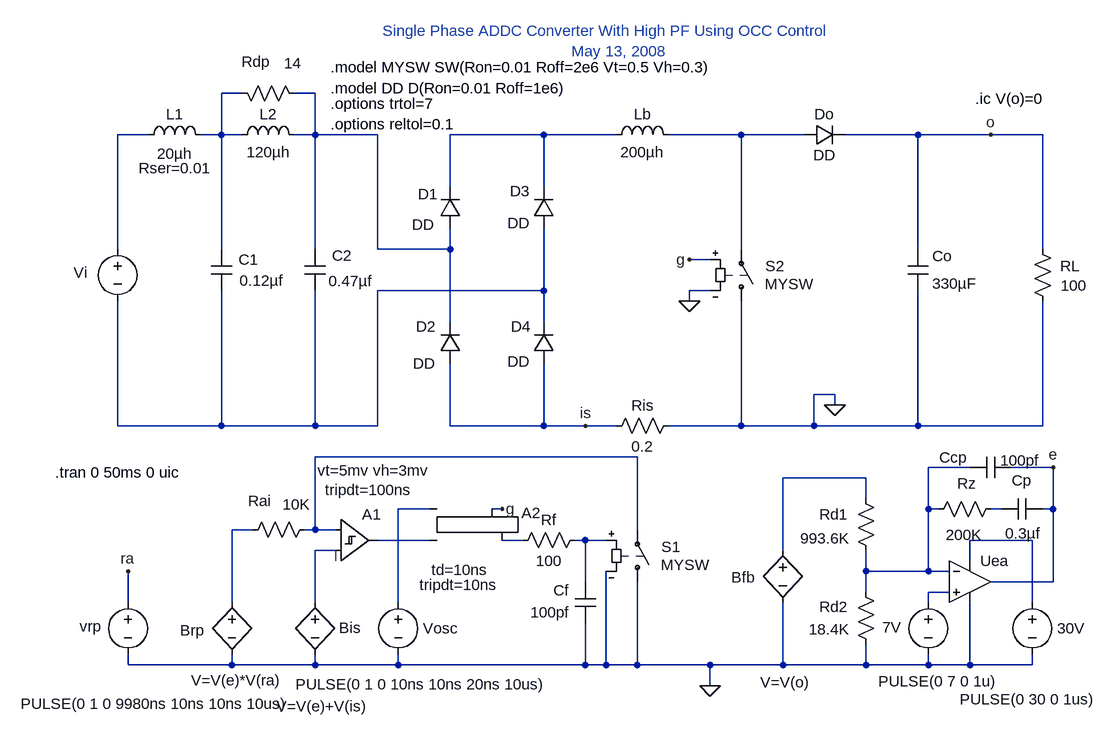
[diagram p0: schematic Single_Phase_High_PF_ACDC_Converter_with_Universalopamp2.asc]
Single_Phase_High_PF_ACDC_Converter_with_Universalopamp2.asc, the LTspice schematic file:
Version 4
SHEET 1 880 680
WIRE -2752 -1920 -2784 -1920
WIRE -2640 -1920 -2672 -1920
WIRE -2896 -1856 -2944 -1856
WIRE -2784 -1856 -2784 -1920
WIRE -2784 -1856 -2816 -1856
WIRE -2752 -1856 -2784 -1856
WIRE -2640 -1856 -2640 -1920
WIRE -2640 -1856 -2672 -1856
WIRE -2544 -1856 -2640 -1856
WIRE -2288 -1856 -2432 -1856
WIRE -2176 -1856 -2288 -1856
WIRE -1984 -1856 -2096 -1856
WIRE -1888 -1856 -1984 -1856
WIRE -1712 -1856 -1824 -1856
WIRE -1600 -1856 -1712 -1856
WIRE -1520 -1856 -1600 -1856
WIRE -2432 -1776 -2432 -1856
WIRE -2288 -1776 -2288 -1856
WIRE -2944 -1680 -2944 -1856
WIRE -2784 -1680 -2784 -1856
WIRE -2640 -1680 -2640 -1856
WIRE -2544 -1680 -2544 -1856
WIRE -2432 -1680 -2432 -1712
WIRE -2432 -1680 -2544 -1680
WIRE -1984 -1680 -1984 -1856
WIRE -1712 -1680 -1712 -1856
WIRE -1520 -1680 -1520 -1856
WIRE -2032 -1664 -2064 -1664
WIRE -2288 -1616 -2288 -1712
WIRE -2288 -1616 -2544 -1616
WIRE -2032 -1616 -2064 -1616
WIRE -2064 -1600 -2064 -1616
WIRE -2432 -1568 -2432 -1680
WIRE -2288 -1568 -2288 -1616
WIRE -1840 -1456 -1872 -1456
WIRE -1840 -1440 -1840 -1456
WIRE -2944 -1408 -2944 -1600
WIRE -2784 -1408 -2784 -1616
WIRE -2784 -1408 -2944 -1408
WIRE -2640 -1408 -2640 -1616
WIRE -2640 -1408 -2784 -1408
WIRE -2544 -1408 -2544 -1616
WIRE -2544 -1408 -2640 -1408
WIRE -2432 -1408 -2432 -1504
WIRE -2288 -1408 -2288 -1504
WIRE -2288 -1408 -2432 -1408
WIRE -2224 -1408 -2288 -1408
WIRE -2176 -1408 -2224 -1408
WIRE -1984 -1408 -1984 -1600
WIRE -1984 -1408 -2096 -1408
WIRE -1872 -1408 -1872 -1456
WIRE -1872 -1408 -1984 -1408
WIRE -1712 -1408 -1712 -1616
WIRE -1712 -1408 -1872 -1408
WIRE -1520 -1408 -1520 -1600
WIRE -1520 -1408 -1712 -1408
WIRE -2144 -1360 -2640 -1360
WIRE -1632 -1344 -1696 -1344
WIRE -1504 -1344 -1568 -1344
WIRE -1792 -1328 -1920 -1328
WIRE -1792 -1296 -1792 -1328
WIRE -2464 -1280 -2512 -1280
WIRE -2352 -1280 -2368 -1280
WIRE -1696 -1280 -1696 -1344
WIRE -1680 -1280 -1696 -1280
WIRE -1584 -1280 -1600 -1280
WIRE -1504 -1280 -1504 -1344
WIRE -1504 -1280 -1520 -1280
WIRE -2736 -1248 -2768 -1248
WIRE -2640 -1248 -2640 -1360
WIRE -2640 -1248 -2656 -1248
WIRE -2608 -1248 -2640 -1248
WIRE -2144 -1248 -2144 -1360
WIRE -2464 -1232 -2544 -1232
WIRE -2320 -1232 -2352 -1232
WIRE -2224 -1232 -2240 -1232
WIRE -2192 -1232 -2224 -1232
WIRE -1536 -1232 -1632 -1232
WIRE -2608 -1216 -2640 -1216
WIRE -1920 -1216 -1920 -1328
WIRE -1632 -1200 -1632 -1232
WIRE -1792 -1184 -1792 -1216
WIRE -1696 -1184 -1696 -1280
WIRE -1696 -1184 -1792 -1184
WIRE -1664 -1184 -1696 -1184
WIRE -2224 -1168 -2224 -1232
WIRE -1504 -1168 -1504 -1280
WIRE -1504 -1168 -1600 -1168
WIRE -1792 -1152 -1792 -1184
WIRE -1664 -1152 -1696 -1152
WIRE -2928 -1136 -2928 -1184
WIRE -2768 -1136 -2768 -1248
WIRE -2640 -1136 -2640 -1216
WIRE -2512 -1136 -2512 -1280
WIRE -1696 -1136 -1696 -1152
WIRE -1536 -1136 -1536 -1232
WIRE -2928 -1040 -2928 -1056
WIRE -2768 -1040 -2768 -1056
WIRE -2768 -1040 -2928 -1040
WIRE -2640 -1040 -2640 -1056
WIRE -2640 -1040 -2768 -1040
WIRE -2512 -1040 -2512 -1056
WIRE -2512 -1040 -2640 -1040
WIRE -2224 -1040 -2224 -1104
WIRE -2224 -1040 -2512 -1040
WIRE -2192 -1040 -2192 -1184
WIRE -2192 -1040 -2224 -1040
WIRE -2144 -1040 -2144 -1168
WIRE -2144 -1040 -2192 -1040
WIRE -2032 -1040 -2144 -1040
WIRE -1920 -1040 -1920 -1136
WIRE -1920 -1040 -2032 -1040
WIRE -1792 -1040 -1792 -1072
WIRE -1792 -1040 -1920 -1040
WIRE -1696 -1040 -1696 -1056
WIRE -1696 -1040 -1792 -1040
WIRE -1632 -1040 -1632 -1136
WIRE -1632 -1040 -1696 -1040
WIRE -1536 -1040 -1536 -1056
WIRE -1536 -1040 -1632 -1040
WIRE -2032 -1008 -2032 -1040
FLAG -1600 -1856 o
FLAG -2928 -1184 ra
FLAG -2352 -1280 g
FLAG -1504 -1344 e
FLAG -2032 -1008 0
FLAG -2064 -1664 g
FLAG -2064 -1600 0
FLAG -2224 -1408 is
FLAG -1840 -1440 0
SYMBOL ind -2192 -1840 R270
WINDOW 0 32 56 VTop 0
WINDOW 3 5 56 VBottom 0
SYMATTR InstName Lb
SYMATTR Value 200µh
SYMATTR Type ind2
SYMATTR SpiceLine Rser=0.01
SYMBOL cap -1728 -1680 R0
WINDOW 0 38 11 Left 0
WINDOW 3 38 53 Left 0
SYMATTR InstName Co
SYMATTR Value 330µF
SYMATTR SpiceLine Rser=0.1
SYMBOL res -1536 -1696 R0
WINDOW 0 43 42 Left 0
WINDOW 3 44 72 Left 0
SYMATTR InstName RL
SYMATTR Value 100
SYMBOL res -2080 -1424 R90
WINDOW 0 0 56 VBottom 0
WINDOW 3 32 56 VTop 0
SYMATTR InstName Ris
SYMATTR Value 0.2
SYMBOL voltage -2928 -1152 R0
WINDOW 0 -74 53 Left 0
WINDOW 3 -165 172 Left 0
WINDOW 123 0 0 Left 0
WINDOW 39 0 0 Left 0
SYMATTR InstName vrp
SYMATTR Value PULSE(0 1 0 9980ns 10ns 10ns 10us)
SYMBOL bv -2768 -1152 R0
WINDOW 0 -80 59 Left 0
WINDOW 3 -63 136 Left 0
SYMATTR InstName Brp
SYMATTR Value V=V(e)*V(ra)
SYMBOL Digital\\diffschmtbuf -2608 -1296 R0
WINDOW 3 -17 -13 Left 0
WINDOW 123 -28 -43 Left 0
SYMATTR Value tripdt=100ns
SYMATTR Value2 vt=5mv vh=3mv
SYMATTR InstName A1
SYMBOL Digital\\srflop -2416 -1328 R0
WINDOW 3 -63 165 Left 0
WINDOW 123 -45 142 Left 0
SYMATTR Value tripdt=10ns
SYMATTR Value2 td=10ns
SYMATTR InstName A2
SYMBOL voltage -2512 -1152 R0
WINDOW 0 38 56 Left 0
WINDOW 3 -158 142 Left 0
WINDOW 123 0 0 Left 0
WINDOW 39 0 0 Left 0
SYMATTR InstName Vosc
SYMATTR Value PULSE(0 1 0 10ns 10ns 20ns 10us)
SYMBOL res -2640 -1264 R90
WINDOW 0 -13 85 VBottom 0
WINDOW 3 -39 29 VTop 0
SYMATTR InstName Rai
SYMATTR Value 10K
SYMBOL sw -2144 -1152 M180
WINDOW 0 37 70 Left 0
WINDOW 3 36 42 Left 0
SYMATTR InstName S1
SYMATTR Value MYSW
SYMBOL res -2224 -1248 R90
WINDOW 0 0 56 VBottom 0
WINDOW 3 32 56 VTop 0
SYMATTR InstName Rf
SYMATTR Value 100
SYMBOL cap -2208 -1168 M0
WINDOW 0 41 13 Left 0
WINDOW 3 40 47 Left 0
SYMATTR InstName Cf
SYMATTR Value 100pf
SYMBOL bv -2640 -1152 R0
WINDOW 0 37 55 Left 0
WINDOW 3 -59 176 Left 0
SYMATTR InstName Bis
SYMATTR Value V=V(e)+V(is)
SYMBOL res -1808 -1312 R0
WINDOW 0 -56 40 Left 0
WINDOW 3 -85 77 Left 0
SYMATTR InstName Rd1
SYMATTR Value 993.6K
SYMBOL res -1808 -1168 R0
WINDOW 0 -56 39 Left 0
WINDOW 3 -72 73 Left 0
SYMATTR InstName Rd2
SYMATTR Value 18.4K
SYMBOL res -1584 -1296 R90
WINDOW 0 -8 53 VBottom 0
WINDOW 3 40 57 VTop 0
SYMATTR InstName Rz
SYMATTR Value 200K
SYMBOL cap -1520 -1296 R90
WINDOW 0 -12 32 VBottom 0
WINDOW 3 38 31 VTop 0
SYMATTR InstName Cp
SYMATTR Value 0.3µf
SYMBOL cap -1568 -1360 R90
WINDOW 0 16 90 VBottom 0
WINDOW 3 -10 -13 VTop 0
SYMATTR InstName Ccp
SYMATTR Value 100pf
SYMBOL voltage -1696 -1152 R0
WINDOW 0 -71 54 Left 0
WINDOW 3 -77 137 Left 0
WINDOW 123 0 0 Left 0
WINDOW 39 0 0 Left 0
SYMATTR InstName 7V
SYMATTR Value PULSE(0 7 0 1u)
SYMBOL bv -1920 -1232 R0
WINDOW 0 -79 57 Left 0
WINDOW 3 -35 219 Left 0
SYMATTR InstName Bfb
SYMATTR Value V=V(o)
SYMBOL voltage -1536 -1152 R0
WINDOW 0 38 56 Left 0
WINDOW 3 -112 165 Left 0
WINDOW 123 0 0 Left 0
WINDOW 39 0 0 Left 0
SYMATTR InstName 30V
SYMATTR Value PULSE(0 30 0 1us)
SYMBOL sw -1984 -1584 M180
WINDOW 0 37 70 Left 0
WINDOW 3 36 42 Left 0
SYMATTR InstName S2
SYMATTR Value MYSW
SYMBOL diode -1888 -1840 R270
WINDOW 0 32 32 VTop 0
WINDOW 3 0 32 VBottom 0
SYMATTR InstName Do
SYMATTR Value DD
SYMBOL voltage -2944 -1696 R0
WINDOW 0 -57 68 Bottom 0
WINDOW 3 32 56 Invisible 0
WINDOW 123 0 0 Left 0
WINDOW 39 0 0 Left 0
SYMATTR InstName Vi
SYMATTR Value SINE(0 134 400)
SYMBOL ind -2912 -1840 R270
WINDOW 0 32 56 VTop 0
WINDOW 3 3 56 VBottom 0
WINDOW 39 -20 57 VBottom 0
SYMATTR InstName L1
SYMATTR Value 20µh
SYMATTR SpiceLine Rser=0.01
SYMBOL ind -2768 -1840 R270
WINDOW 0 32 56 VTop 0
WINDOW 3 5 56 VBottom 0
SYMATTR InstName L2
SYMATTR Value 120µh
SYMATTR SpiceLine Rser=0.01
SYMBOL cap -2800 -1680 R0
WINDOW 0 42 16 Left 0
WINDOW 3 44 48 Left 0
SYMATTR InstName C1
SYMATTR Value 0.12µf
SYMATTR SpiceLine Rser=0.01 Cpar=100pf
SYMBOL cap -2656 -1680 R0
WINDOW 0 42 10 Left 0
WINDOW 3 37 49 Left 0
SYMATTR InstName C2
SYMATTR Value 0.47µf
SYMATTR SpiceLine Rser=0.01 Cpar=100pf
SYMBOL res -2768 -1936 M90
WINDOW 0 -17 37 VBottom 0
WINDOW 3 -46 94 VTop 0
SYMATTR InstName Rdp
SYMATTR Value 14
SYMBOL diode -2416 -1504 R180
WINDOW 0 38 57 Left 0
WINDOW 3 39 0 Left 0
SYMATTR InstName D2
SYMATTR Value DD
SYMBOL diode -2416 -1712 R180
WINDOW 0 35 53 Left 0
WINDOW 3 40 6 Left 0
SYMATTR InstName D1
SYMATTR Value DD
SYMBOL diode -2272 -1504 R180
WINDOW 0 36 57 Left 0
WINDOW 3 37 3 Left 0
SYMATTR InstName D4
SYMATTR Value DD
SYMBOL diode -2272 -1712 R180
WINDOW 0 37 57 Left 0
WINDOW 3 37 8 Left 0
SYMATTR InstName D3
SYMATTR Value DD
SYMBOL Opamps\\UniversalOpamp2 -1632 -1168 R0
SYMATTR InstName Uea
TEXT -2616 -1960 Left 0 !.model MYSW SW(Ron=0.01 Roff=2e6 Vt=0.5 Vh=0.3)
TEXT -2616 -1928 Left 0 !.model DD D(Ron=0.01 Roff=1e6)
TEXT -3040 -1336 Left 0 !.tran 0 50ms 0 uic
TEXT -2616 -1904 Left 0 !.options trtol=7\n.options reltol=0.1
TEXT -1624 -1912 Left 0 !.ic V(o)=0
TEXT -2536 -2016 Left 0 ;Single Phase ADDC Converter With High PF Using OCC Control\n                                          May 13, 2008

The netlist it stands for:
* Single_Phase_High_PF_ACDC_Converter_with_Universalopamp2.asc
Lb N004 N005 200µh Rser=0.01
Co o 0 330µF Rser=0.1
RL o 0 100
Ris 0 is 0.2
vrp ra 0 PULSE(0 1 0 9980ns 10ns 10ns 10us)
Brp N012 0 V=V(e)*V(ra)
A1 N007 N017 0 0 0 0 N013 0 SCHMITT tripdt=100ns vt=5mv vh=3mv
A2 N010 N013 0 0 0 N014 g 0 SRFLOP tripdt=10ns td=10ns
Vosc N010 0 PULSE(0 1 0 10ns 10ns 20ns 10us)
Rai N007 N012 10K
S1 0 N007 N015 0 MYSW
Rf N015 N014 100
Cf N015 0 100pf
Bis N017 0 V=V(e)+V(is)
Rd1 N009 N008 993.6K
Rd2 N008 0 18.4K
Rz N011 N008 200K
Cp e N011 0.3µf
Ccp e N008 100pf
V§7V N018 0 PULSE(0 7 0 1u)
Bfb N009 0 V=V(o)
V§30V N016 0 PULSE(0 30 0 1us)
S2 0 N005 g 0 MYSW
Do N005 o DD
Vi N003 N006 SINE(0 134 400)
L1 N003 N001 20µh Rser=0.01
L2 N001 N002 120µh Rser=0.01
C1 N001 N006 0.12µf Rser=0.01 Cpar=100pf
C2 N002 N006 0.47µf Rser=0.01 Cpar=100pf
Rdp N001 N002 14
D2 is N002 DD
D1 N002 N004 DD
D4 is N006 DD
D3 N006 N004 DD
XUea N018 N008 N016 0 e level.2 Avol=1Meg GBW=10Meg Slew=10Meg ilimit=25m rail=0 Vos=0 phimargin=45 en=0 enk=0 in=0 ink=0 Rin=500Meg  ; pins IN+ IN- V+ V- OUT
.model D D
.lib standard.dio
.model MYSW SW(Ron=0.01 Roff=2e6 Vt=0.5 Vh=0.3)
.model DD D(Ron=0.01 Roff=1e6)
.tran 0 50ms 0 uic
.options trtol=7
.options reltol=0.1
.ic V(o)=0
* Single Phase ADDC Converter With High PF Using OCC Control
*                                           May 13, 2008
.lib UniversalOpamps2.sub
.backanno
.end